# Altium schematic sheet Doors lighting control.SchDoc
size A4
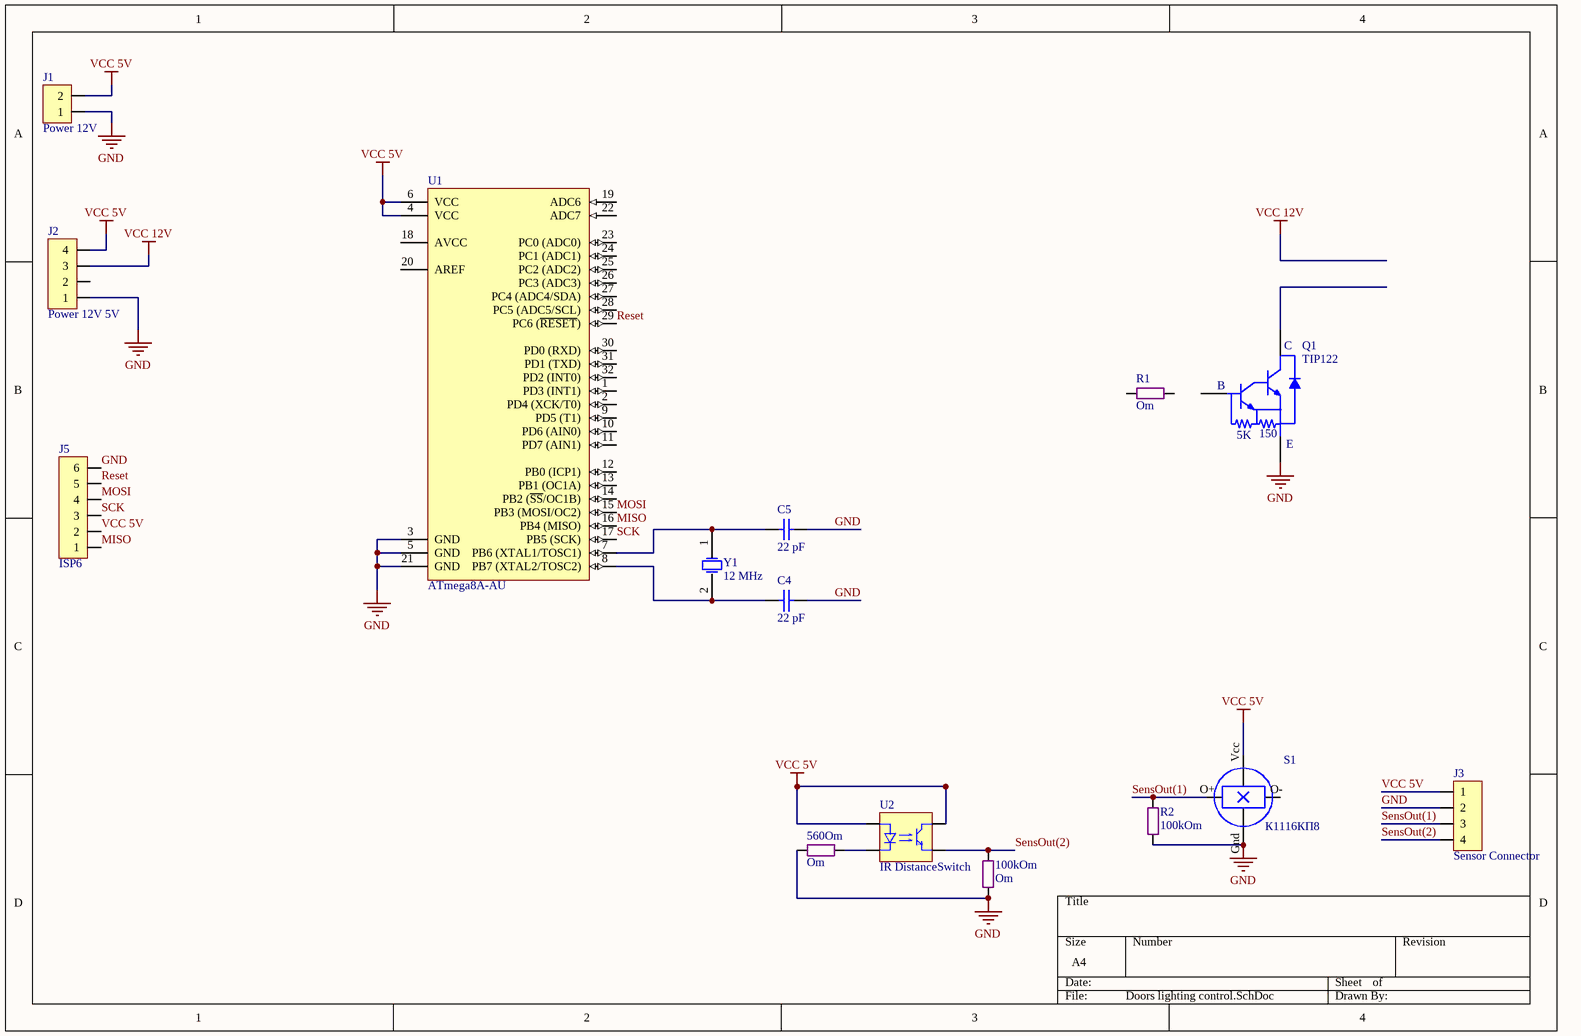
[diagram p0: Doors lighting control.SchDoc]

## Parts
100kOm  Om  [SMD 0805 (2012)]
560Om  Om  [SMD 0805 (2012)]
C4  22 pF  [Cap P5.08MM (3p) disk2]
C5  22 pF  [Cap P5.08MM (3p) disk2]
J1  Power 12V  [Molex Micro-Fit 3.0 - 2 pin D R]
J2  Power 12V 5V  [Molex Micro-Fit 3.0 - 4 pin D R]
J3  Sensor Connector  [Molex Micro-Fit 3.0 - 4 pin D R]
J5  ISP6  [LINE 2.54 x 6D (2 x 3)]
Q1  TIP122  [TO220-2]
R1  Om  [SMD 0805 (2012)]
R2  100kOm  [SMD 0805 (2012)]
S1  Name: К1116КП8  [Hall Sensor 3Pin]  (hidden comment: Hall Sens)
U1  ATmega8A-AU  [32A_N]
U2  IR DistanceSwitch  [OptoSwitchDistance]
Y1  12 MHz  [XTAL - 2]

## Nets
GND: 100kOm.1 560Om.2 C4.1 C5.1 J1.1 J2.1 J3.2 J5.6 Q1.3(E) R2.1 S1.Gnd U1.3(GND) U1.5(GND) U1.21(GND)
VCC 5V: J1.2 J2.4 J3.1 J5.2 S1.Vcc U1.4(VCC) U1.6(VCC) U2.A U2.C
VCC 12V: J2.3
MISO: J5.1 U1.16(PB4_(MISO))
MOSI: J5.4 U1.15(PB3_(MOSI/OC2))
Reset: J5.5 U1.29(PC6_(~{RESET}))
SCK: J5.3 U1.17(PB5_(SCK))
SensOut(1): J3.3 R2.2 S1.O+
SensOut(2): 100kOm.2 J3.4 U2.E
Net560Om_1: 560Om.1 U2.K
NetC4_2: C4.2 U1.8(PB7_(XTAL2/TOSC2)) Y1.2(OSC2)
NetC5_2: C5.2 U1.7(PB6_(XTAL1/TOSC1)) Y1.1(OSC1)

Not connected (* = marked no-connect by the designer): J2 2; Q1 1(B) 2(C); R1 1 2; S1 O-; U1 1(PD3_(INT1)) 2(PD4_(XCK/T0)) 9(PD5_(T1)) 10(PD6_(AIN0)) 11(PD7_(AIN1)) 12(PB0_(ICP1)) 13(PB1_(OC1A)) 14(PB2_(~{SS}/OC1B)) 18(AVCC) 19(ADC6) 20(AREF) 22(ADC7) 23(PC0_(ADC0)) 24(PC1_(ADC1)) 25(PC2_(ADC2)) 26(PC3_(ADC3)) 27(PC4_(ADC4/SDA)) 28(PC5_(ADC5/SCL)) 30(PD0_(RXD)) 31(PD1_(TXD)) 32(PD2_(INT0))

## Notes on the sheet
- (in symbol TIP122) 5K; 150

## Library data of the parts
100kOm 560Om R1 R2 = Res All Types
C4 C5 = Cap Ceramic: Capacitor
J1 = Micro-Fit 2R (1x2): Horisontal, Dbl line, Male - 3mm; Part Number: 430450200; Name: Micro-Fit 3.0; URL: http://www.molex.com/molex/products/datasheet.jsp?part=active/0430450200_PCB_HEADERS.xml
J2 J3 = Micro-Fit 4R (2x2): Horisontal, Dbl line, Male - 3mm; Part Number: 0430450402; Name: Micro-Fit 3.0; URL: http://www.molex.com/molex/products/datasheet.jsp?part=active/0430450402_PCB_HEADERS.xml
J5 = PLD-6 (2 x 3): Vert, Dbl line, Male
Q1 = TIP122: NPN Darlington 5A, 65W, 100V, h>1000; I imp: 8A; h21e: >1000; Code_JEDEC: TO-220; U max: 100V; I max: 5A; P max: 65W; Channnel: NPN
S1 = Hall Sensor K1116KP8
U1 = ATmega8A-AU: 8-bit AVR Microcontroller, 8KB Flash, 512 Bytes EEPROM, 1KB SRAM, 32-pin TQFP, Industrial Grade (-40°C to 85°C); Published: 1-Apr-2010; DatasheetVersion: revC, Jul-2009; PackageVersion: revB, Oct-2001; PackageReference: 32A; Publisher: Altium Limited; PackageDescription: 32-Lead, 7x7x1.0 mm Body, 0.8mm Lead Pitch, Thin Profile Plastic Quad Flat Package (TQFP); Supplier 1: Digi-Key; Supplier Part Number 1: ATMEGA8A-AU-ND; Supplier 2: Farnell; Supplier Part Number 2: 1748532; Supplier 3: Mouser; Supplier Part Number 3: 556-ATMEGA8A-AU; Code_JEDEC: MS-026-ABA; ComponentLink1Description: Manufacturer Link; ComponentLink1URL: http://www.atmel.com/products/avr/default.asp?; ComponentLink2Description: ATmega8A Datasheet; ComponentLink2URL: http://www.atmel.com/dyn/resources/prod_documents/doc8159.pdf; ComponentLink3Description: ATmega8A Summary; ComponentLink3URL: http://www.atmel.com/dyn/resources/prod_documents/8159S.pdf; ComponentLink4Description: Atmel.com Home; ComponentLink4URL: http://www.atmel.com
U2 = Optocouplier (IR Distance Switch): IR opt Distance Switch; Name: TCRT5000; I Forward: 60 mA; Power dissipation: 100mW; Datasheet: http://www.vishay.com/docs/83760/tcrt5000.pdf
Y1 = XTAL: Crystal Oscillator; Published: 8-Jun-2000; LatestRevisionDate: 17-Jul-2002; LatestRevisionNote: Re-released for DXP Platform.; PackageReference: R38; Publisher: Altium Limited; PackageDescription: Crystal, Thru-Hole; 2 Leads; Body 3.1 x 8.2 mm (Dia.xH)